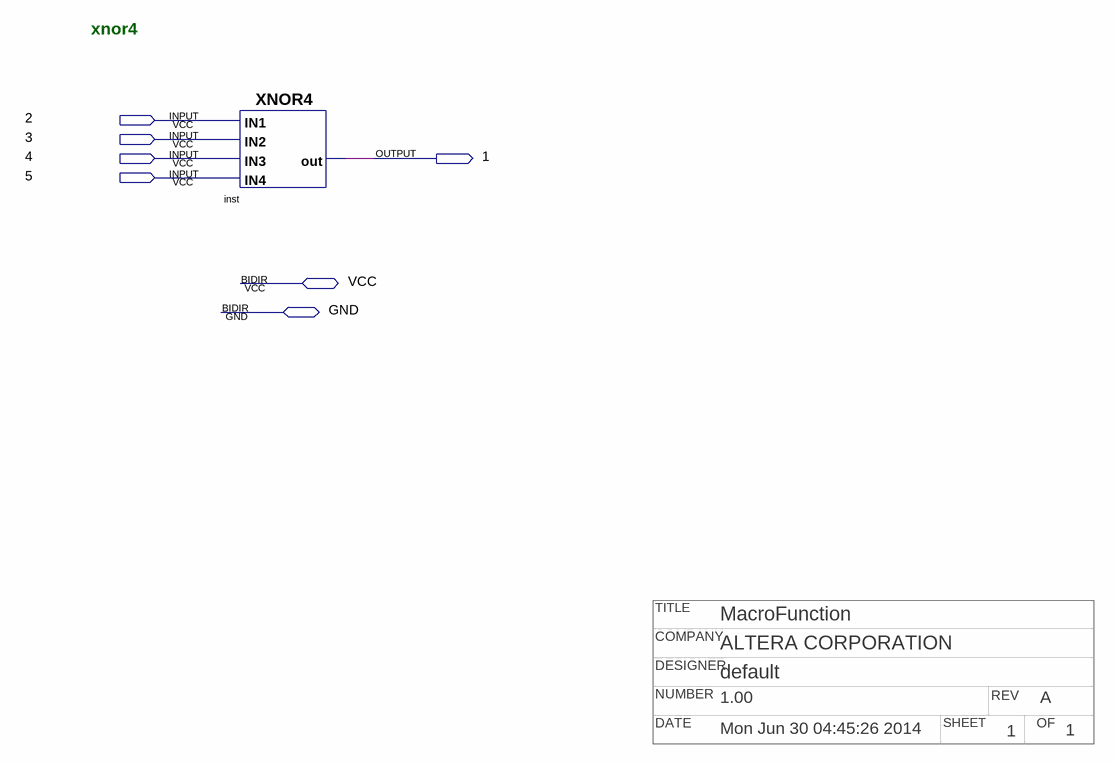
[diagram p0: schematic sheet]
// Quartus schematic npxnor4.bdf as structural Verilog: 1 symbols, 7 pins
// Title block: TITLE: MacroFunction; COMPANY: ALTERA CORPORATION; DESIGNER: default; NUMBER: 1.00; REV: A; DATE: Mon Jun 30 04:45:26 2014; SHEET: 1; OF: 1
module npxnor4 (
  input  \2 ,
  input  \3 ,
  input  \4 ,
  input  \5 ,
  inout  VCC,
  inout  GND,
  output \1 
);

  XNOR4 inst (.IN4(\5 ), .IN2(\3 ), .IN3(\4 ), .IN1(\2 ), .out(\1 ));

  // Notes on the sheet:
  //   xnor4
endmodule
